# EAGLE schematic Pyr0-Piezo_SingleDisk_Adapter_3pin (EAGLE 9.5.2)
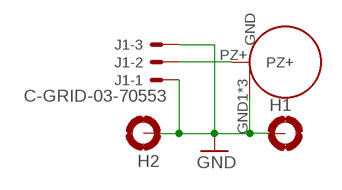
[diagram p0: schematic, sheet 1]

## Parts
H1  HOLES_MOUNT-PAD-ROUND3.2  [HOLES_3,2-PAD]
H2  HOLES_MOUNT-PAD-ROUND3.2  [HOLES_3,2-PAD]
J1  C-GRID-03-70553  [70553-03]
PZ1  PIEZO-DISK12MM-OFFSET  [PIEZO-DISK-12MM-OFFSET]

## Nets
GND: H1.B3,2(MOUNT) H2.B3,2(MOUNT) J1.1 J1.3 PZ1.GND1(GND) PZ1.GND2(GND) PZ1.GND3(GND)
PZ+: J1.2 PZ1.PZ+

## Library data of the parts
H1 H2 = PiezoFFC:HOLES_MOUNT-PAD-ROUND: MOUNTING PAD, round
J1 = PiezoFFC:C-GRID-03: CONNECTOR wire to board 2.54 mm (0.100") pitch header; MF: MOLEX; OC_FARNELL: unknown; OC_NEWARK: unknown
PZ1 = PiezoFFC:PIEZO-DISK